# EAGLE design schematic (EAGLE 9.6.2)
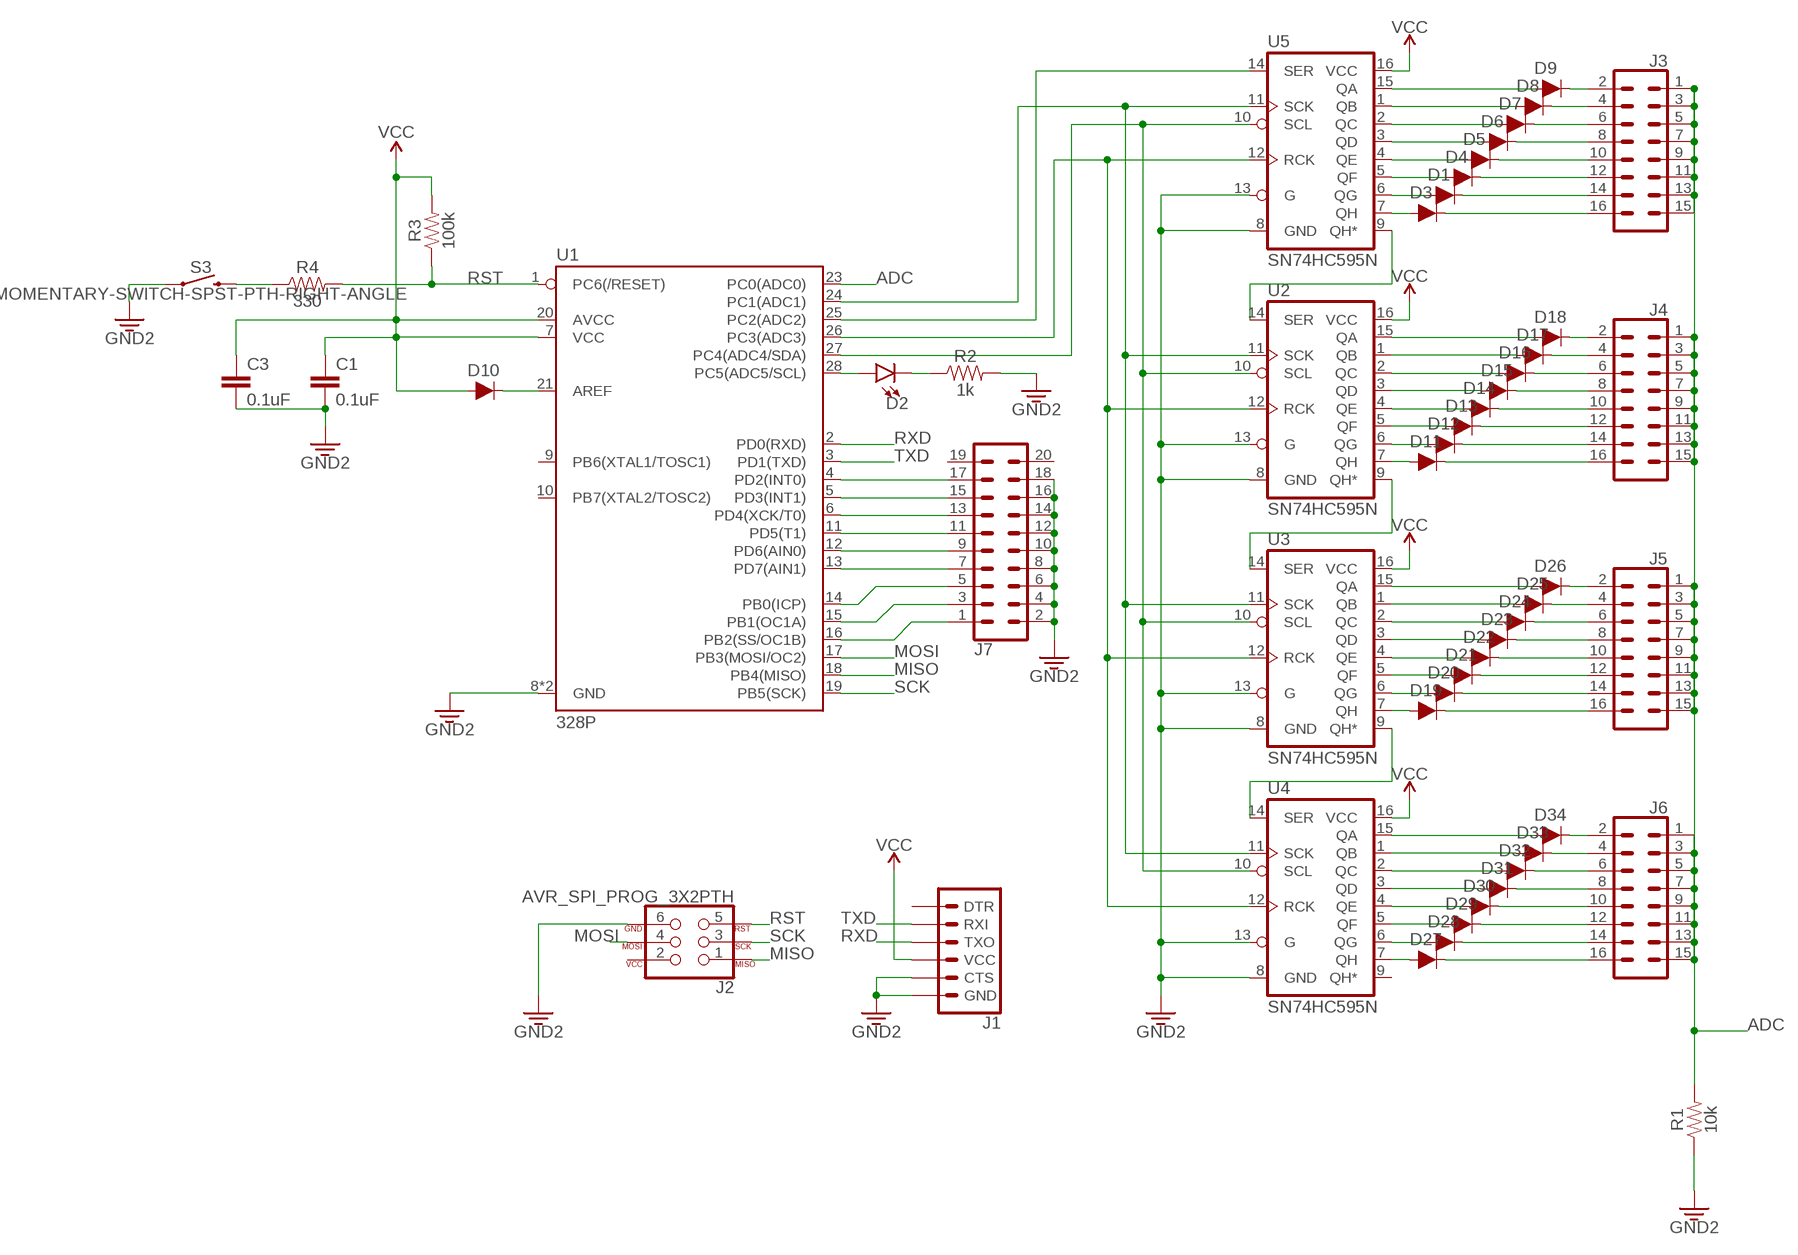
[diagram p0: schematic, sheet 1]

## Parts
C1  0.1uF  0.1UF-KIT-EZ-50V-20%  [CAP-PTH-SMALL-KIT]
C3  0.1uF  0.1UF-KIT-EZ-50V-20%  [CAP-PTH-SMALL-KIT]
D1  200mA/100V/1V  DIODE-1N4148  [DIODE-1N4148]
D2  LED5MM  [LED_5MM]
D3  200mA/100V/1V  DIODE-1N4148  [DIODE-1N4148]
D4  200mA/100V/1V  DIODE-1N4148  [DIODE-1N4148]
D5  200mA/100V/1V  DIODE-1N4148  [DIODE-1N4148]
D6  200mA/100V/1V  DIODE-1N4148  [DIODE-1N4148]
D7  200mA/100V/1V  DIODE-1N4148  [DIODE-1N4148]
D8  200mA/100V/1V  DIODE-1N4148  [DIODE-1N4148]
D9  200mA/100V/1V  DIODE-1N4148  [DIODE-1N4148]
D10  200mA/100V/1V  DIODE-1N4148  [DIODE-1N4148]
D11  200mA/100V/1V  DIODE-1N4148  [DIODE-1N4148]
D12  200mA/100V/1V  DIODE-1N4148  [DIODE-1N4148]
D13  200mA/100V/1V  DIODE-1N4148  [DIODE-1N4148]
D14  200mA/100V/1V  DIODE-1N4148  [DIODE-1N4148]
D15  200mA/100V/1V  DIODE-1N4148  [DIODE-1N4148]
D16  200mA/100V/1V  DIODE-1N4148  [DIODE-1N4148]
D17  200mA/100V/1V  DIODE-1N4148  [DIODE-1N4148]
D18  200mA/100V/1V  DIODE-1N4148  [DIODE-1N4148]
D19  200mA/100V/1V  DIODE-1N4148  [DIODE-1N4148]
D20  200mA/100V/1V  DIODE-1N4148  [DIODE-1N4148]
D21  200mA/100V/1V  DIODE-1N4148  [DIODE-1N4148]
D22  200mA/100V/1V  DIODE-1N4148  [DIODE-1N4148]
D23  200mA/100V/1V  DIODE-1N4148  [DIODE-1N4148]
D24  200mA/100V/1V  DIODE-1N4148  [DIODE-1N4148]
D25  200mA/100V/1V  DIODE-1N4148  [DIODE-1N4148]
D26  200mA/100V/1V  DIODE-1N4148  [DIODE-1N4148]
D27  200mA/100V/1V  DIODE-1N4148  [DIODE-1N4148]
D28  200mA/100V/1V  DIODE-1N4148  [DIODE-1N4148]
D29  200mA/100V/1V  DIODE-1N4148  [DIODE-1N4148]
D30  200mA/100V/1V  DIODE-1N4148  [DIODE-1N4148]
D31  200mA/100V/1V  DIODE-1N4148  [DIODE-1N4148]
D32  200mA/100V/1V  DIODE-1N4148  [DIODE-1N4148]
D33  200mA/100V/1V  DIODE-1N4148  [DIODE-1N4148]
D34  200mA/100V/1V  DIODE-1N4148  [DIODE-1N4148]
J1  6_PIN_SERIAL_TARGETLOCK  [1X06_LOCK]
J2  AVR_SPI_PROG_3X2PTH  [2X3]
J3  CONN_08X2_HEADER  [2X8]
J4  CONN_08X2_HEADER  [2X8]
J5  CONN_08X2_HEADER  [2X8]
J6  CONN_08X2_HEADER  [2X8]
J7  CONN_10X2  [2X10]
R1  10k  10KOHM-HORIZ-1/4W-1%  [AXIAL-0.3]
R2  1k  1KOHM-HORIZ-1/4W-1%  [AXIAL-0.3]
R3  100k  100KOHM-HORIZ-1/4W-5%  [AXIAL-0.3]
R4  330  1KOHM-HORIZ-1/4W-1%  [AXIAL-0.3]
S3  MOMENTARY-SWITCH-SPST-PTH-RIGHT-ANGLE  [TACTILE_SWITCH_PTH_RIGHT_ANGLE]
U1  328P  ATMEGA328P_PDIP  [DIP28]
U2  SN74HC595N  74HC595N  [DIP16]
U3  SN74HC595N  74HC595N  [DIP16]
U4  SN74HC595N  74HC595N  [DIP16]
U5  SN74HC595N  74HC595N  [DIP16]

## Nets
ADC: J3.1 J3.3 J3.5 J3.7 J3.9 J3.11 J3.13 J3.15 J4.1 J4.3 J4.5 J4.7 J4.9 J4.11 J4.13 J4.15 J5.1 J5.3 J5.5 J5.7 J5.9 J5.11 J5.13 J5.15 J6.1 J6.3 J6.5 J6.7 J6.9 J6.11 J6.13 J6.15 R1.P$2 U1.23(PC0(ADC0))
GND: C1.2 C3.2 J1.5(CTS) J1.6(GND) J2.6 J7.2 J7.4 J7.6 J7.8 J7.10 J7.12 J7.14 J7.16 J7.18 R1.P$1 R2.P$2 S3.1 U1.8(GND) U1.22(GND) U2.8(GND) U2.13(G) U3.8(GND) U3.13(G) U4.8(GND) U4.13(G) U5.8(GND) U5.13(G) ; supply symbol labelled GND2
MISO: J2.1 U1.18(PB4(MISO))
MOSI: J2.4 U1.17(PB3(MOSI/OC2))
N$1: U1.24(PC1(ADC1)) U2.11(SCK) U3.11(SCK) U4.11(SCK) U5.11(SCK)
N$2: D18.A U2.15(QA)
N$3: U1.25(PC2(ADC2)) U5.14(SER)
N$4: U1.26(PC3(ADC3)) U2.12(RCK) U3.12(RCK) U4.12(RCK) U5.12(RCK)
N$5: U1.27(PC4(ADC4/SDA)) U2.10(SCL) U3.10(SCL) U4.10(SCL) U5.10(SCL)
N$6: D9.C J3.2
N$7: D8.A U5.1(QB)
N$8: D8.C J3.4
N$9: D9.A U5.15(QA)
N$10: D7.A U5.2(QC)
N$11: D7.C J3.6
N$12: D6.A U5.3(QD)
N$13: D6.C J3.8
N$14: D5.A U5.4(QE)
N$15: D5.C J3.10
N$16: D4.A U5.5(QF)
N$17: D4.C J3.12
N$18: D1.A U5.6(QG)
N$19: D1.C J3.14
N$20: D3.A U5.7(QH)
N$21: D3.C J3.16
N$22: U2.14(SER) U5.9(QH*)
N$23: U2.9(QH*) U3.14(SER)
N$24: U3.9(QH*) U4.14(SER)
N$25: D18.C J4.2
N$26: D17.C J4.4
N$27: D16.C J4.6
N$28: D15.C J4.8
N$29: D14.C J4.10
N$30: D13.C J4.12
N$31: D12.C J4.14
N$32: D11.C J4.16
N$33: D11.A U2.7(QH)
N$34: D12.A U2.6(QG)
N$35: D13.A U2.5(QF)
N$36: D14.A U2.4(QE)
N$37: D15.A U2.3(QD)
N$38: D16.A U2.2(QC)
N$39: D17.A U2.1(QB)
N$40: D26.A U3.15(QA)
N$41: D19.C J5.16
N$42: D20.C J5.14
N$43: D25.A U3.1(QB)
N$44: D24.A U3.2(QC)
N$45: D21.C J5.12
N$46: D22.C J5.10
N$47: D23.A U3.3(QD)
N$48: D22.A U3.4(QE)
N$49: D23.C J5.8
N$50: D24.C J5.6
N$51: D21.A U3.5(QF)
N$52: D20.A U3.6(QG)
N$53: D25.C J5.4
N$54: D26.C J5.2
N$55: D19.A U3.7(QH)
N$56: D34.A U4.15(QA)
N$57: D27.C J6.16
N$58: D28.C J6.14
N$59: D29.C J6.12
N$60: D30.C J6.10
N$61: D31.C J6.8
N$62: D32.C J6.6
N$63: D33.C J6.4
N$64: D34.C J6.2
N$65: D27.A U4.7(QH)
N$66: D28.A U4.6(QG)
N$67: D29.A U4.5(QF)
N$68: D30.A U4.4(QE)
N$69: D31.A U4.3(QD)
N$70: D32.A U4.2(QC)
N$71: D33.A U4.1(QB)
N$72: D10.C U1.21(AREF)
N$73: D2.A U1.28(PC5(ADC5/SCL))
N$74: D2.K(C) R2.P$1
N$75: J7.1 U1.16(PB2(SS/OC1B))
N$76: J7.3 U1.15(PB1(OC1A))
N$77: J7.5 U1.14(PB0(ICP))
N$78: J7.7 U1.13(PD7(AIN1))
N$79: J7.9 U1.12(PD6(AIN0))
N$80: J7.11 U1.11(PD5(T1))
N$81: J7.13 U1.6(PD4(XCK/T0))
N$82: J7.15 U1.5(PD3(INT1))
N$83: J7.17 U1.4(PD2(INT0))
N$84: R4.P$1 S3.2
RST: J2.5 R3.P$1 R4.P$2 U1.1(PC6(/RESET))
RXD: J1.3(TXO) U1.2(PD0(RXD))
SCK: J2.3 U1.19(PB5(SCK))
TXD: J1.2(RXI) U1.3(PD1(TXD))
VCC: C1.1 C3.1 D10.A J1.4(VCC) R3.P$2 U1.7(VCC) U1.20(AVCC) U2.16(VCC) U3.16(VCC) U4.16(VCC) U5.16(VCC)
Unconnected: J1.1(DTR) J2.2 J7.19 J7.20 U1.9(PB6(XTAL1/TOSC1)) U1.10(PB7(XTAL2/TOSC2)) U4.9(QH*)

## Library data of the parts
C1 C3 = SparkFun-Capacitors:0.1UF: 0.1µF ceramic capacitors A capacitor is a passive two-terminal electrical component used to store electrical energy temporarily in an electric field.; PROD_ID: CAP-08370
D1 D3-D34 = SparkFun-DiscreteSemi:DIODE: Diode These are standard reverse protection diodes and small signal diodes. SparkFun Products: SparkFun SparkPunk Sound Kit <https://www.sparkfun.com/products/11177> SparkFun ESP8266 Thing <https://www.sparkfun.com/products/13231>; PROD_ID: DIO-08378
D2 = SparkFun-LED:LED: LED (Generic) Standard schematic elements and footprints for 5mm, 3mm, 1206, and 0603 sized LEDs. Generic LEDs with no color specified.
J1 = SparkFun-Connectors:6_PIN_SERIAL_TARGET: 6-pin header connection for use with the "FTDI BASIC" pinout - TARGET SIDE. Also known as "Arduino Serial Program Header". It is used to mate with our FTDI Basic serial programmers using the Arduino IDE. Note, this device has "TARGET" in the name. It is intended to be used on a design that contains a target micro-controller that you wish to program. The "sister" device, named "CABLE" is inteneded to be used on a design that usually lives on the end of your USB cable and prvides the converter chip (FTDI232 or FTDI231x) to commnicate serial RX/TX. You can populate with some of these: Break Away Headers - Straight <https://www.sparkfun.com/products/116> (PRT-00116) For reference (or to suit your programming needs) check out these designs: SparkFun FTDI Basic Breakout - 5V <https://www.sparkfun.com/products/9716> (DEV-09716) SparkFun FTDI Basic Breakout - 3.3V <https://www.sparkfun.com/products/9873> (DEV-09873) SparkFun FTDI SmartBasic <https://www.sparkfun.com/products/12935> (DEV-12935) SparkFun Beefy 3 - FTDI Basic Breakout <https://www.sparkfun.com/products/13746> (DEV-13746); PROD_ID: CONN-08437
J2 = SparkFun-Connectors:AVR_SPI_PROG_3X2: AVR ISP 6 Pin This is the reduced ISP connector for AVR programming. Common on Arduino. This footprint will take up less PCB space and can be used with a 10-pin to 6-pin adapter such as SKU: BOB-08508 **Special note about "TEST_POINT" package. The stop mask is on the top side, so if you want your programming test points to be on the bottom of your board, make sure to place this package on the bottom side of the board. This also ensure that the orientation to program from the bottom side will be correct. SparkFun Products: SparkFun ISP Pogo Adapter <https://www.sparkfun.com/products/11591> - NS Tiny AVR Programmer <https://www.sparkfun.com/products/11801> -PTH
J3-J6 = SparkFun-Connectors:CONN_08X2: Multi connection point. Often used as Generic Header-pin footprint for 0.1 inch spaced/style header connections You can populate with any combo of single row headers, but if you'd like an exact match, check this: Header - 2x8 (Male, 0.1") <https://www.sparkfun.com/products/13156> (PRT-13156) On any of the 0.1 inch spaced packages, you can populate with these: Break Away Headers - Straight <https://www.sparkfun.com/products/116> (PRT-00116) Break Away Male Headers - Right Angle <https://www.sparkfun.com/products/553> (PRT-00553) Female Headers <https://www.sparkfun.com/products/115> (PRT-00115) Break Away Headers - Machine Pin <https://www.sparkfun.com/products/117> (PRT-00117) Break Away Female Headers - Swiss Machine Pin <https://www.sparkfun.com/products/743> (PRT-00743)
J7 = SparkFun-Connectors:CONN_10X2: Multi connection point. Often used as Generic Header-pin footprint for 0.1 inch spaced/style header connections On any of the 0.1 inch spaced packages, you can populate with these: Break Away Headers - Straight <https://www.sparkfun.com/products/116> (PRT-00116) Break Away Male Headers - Right Angle <https://www.sparkfun.com/products/553> (PRT-00553) Female Headers <https://www.sparkfun.com/products/115> (PRT-00115) Break Away Headers - Machine Pin <https://www.sparkfun.com/products/117> (PRT-00117) Break Away Female Headers - Swiss Machine Pin <https://www.sparkfun.com/products/743> (PRT-00743) Special note about the "SPECIAL" package: This was SPECIALLY designed to be used with our Graphic LCD Backpack. Be sure you want to use this! It is not only staggered on each line of header holes, but IT IS ALSO offset of the center point of the top and bottom lines by 5 mil. This causes the headers to lock into place on the "standard" footprint on the LCD screen. The extra squares on the tdocu layer are there simply to reference other pins (if you were to actually populate a longer header than ten long - this is what we do with the backpacks).
R1 = SparkFun-Resistors:10KOHM: 10kΩ resistor A resistor is a passive two-terminal electrical component that implements electrical resistance as a circuit element. Resistors act to reduce current flow, and, at the same time, act to lower voltage levels within circuits. - Wikipedia; PROD_ID: RES-12183
R2 = SparkFun-Resistors:1KOHM: 1kΩ resistor A resistor is a passive two-terminal electrical component that implements electrical resistance as a circuit element. Resistors act to reduce current flow, and, at the same time, act to lower voltage levels within circuits. - Wikipedia; PROD_ID: RES-12182
R3 = SparkFun-Resistors:100KOHM: 100kΩ resistor A resistor is a passive two-terminal electrical component that implements electrical resistance as a circuit element. Resistors act to reduce current flow, and, at the same time, act to lower voltage levels within circuits. - Wikipedia; PROD_ID: RES-10686
R4 = SparkFun-Resistors:1KOHM: 1kΩ resistor A resistor is a passive two-terminal electrical component that implements electrical resistance as a circuit element. Resistors act to reduce current flow, and, at the same time, act to lower voltage levels within circuits. - Wikipedia; PROD_ID: RES-12182; VALUE: 1k
S3 = SparkFun-Switches:MOMENTARY-SWITCH-SPST: Momentary Switch (Pushbutton) - SPST Normally-open (NO) SPST momentary switches (buttons, pushbuttons). Variants PTH-12MM - 12mm square, through-hole Momentary Pushbutton Switch - 12mm Square <https://www.sparkfun.com/products/9190> (COM-09190) PTH-6.0MM, PTH-6.0MM-KIT - 6.0mm square, through-hole Mini Pushbutton Switch <https://www.sparkfun.com/products/97> (COM-00097) KIT package intended for soldering kit's - only one side of pads' copper is exposed. PTH-RIGHT-ANGLE-KIT - Right-angle, through-hole Right Angle Tactile Button <https://www.sparkfun.com/products/10791> - Used on SparkFun BigTime Watch Kit <https://www.sparkfun.com/products/11734> SMD-12MM - 12mm square, surface-mount Tactile Button - SMD (12mm) <https://www.sparkfun.com/products/12993> (COM-12993) Used on SparkFun PicoBoard <https://www.sparkfun.com/products/11888> SMD-4.5MM - 4.5mm Square Trackball Switch Used on SparkFun Blackberry Trackballer Breakout <https://www.sparkfun.com/products/13169> SMD-4.6MMX2.8MM - 4.60mm x 2.80mm, surface mount Used on SparkFun Pro Micro - RP2040 <https://www.sparkfun.com/products/17717> SMD-5.2MM, SMD-5.2-REDUNDANT - 5.2mm square, surface-mount Mini Pushbutton Switch - SMD <https://www.sparkfun.com/products/8720> (COM-08720) Used on Arduino Pro Mini <https://www.sparkfun.com/products/11114> REDUNDANT package connects both switch circuits together SMD-6.0X3.5MM - 6.0 x 3.5mm, surface mount Momentary Reset Switch SMD <https://www.sparkfun.com/products/8229> (COM-08229) SMD-6.2MM-TALL - 6.2mm square, surface mount Tactile Button - SMD (6mm) <https://www.sparkfun.com/products/12992> Used on SparkFun Digital Sandbox <https://www.sparkfun.com/products/12651> SMD-RIGHT-ANGLE - Right-angle, surface mount Used on SparkFun Block for Intel® Edison - Arduino <https://www.sparkfun.com/products/13036>; PROD_ID: CONN-10672; SF_SKU: COM-10791
U1 = SparkFun-IC-Microcontroller:ATMEGA328P_PDIP: Atmel 328P Through hole ATMEGA328P uC used in the Arduino 32kb flash, 1k EEPROM, 2k SRAM Datasheet <http://www.sparkfun.com/datasheets/Components/SMD/ATMega328.pdf> SparkFun Products Storefront component: AVR 28 Pin 20MHz 32K 6A/D - ATMega328P <https://www.sparkfun.com/products/9061> (COM-09061) SparkFun Simon Says - Through-Hole Soldering Kit <https://www.sparkfun.com/products/10547> (KIT-10547) SparkFun Learn to Solder - Simon Says <https://www.sparkfun.com/products/13708> (KIT-13708) SparkFun BigTime Watch Kit <https://www.sparkfun.com/products/11734> (KIT-11734) SparkFun ClockIt <https://www.sparkfun.com/products/10930> (KIT-10930) SparkFun Serial Enabled LCD Kit <https://www.sparkfun.com/products/10097> (LCD-10097) SparkFun Simon Tilts - Through Hole Soldering Kit <https://www.sparkfun.com/products/12634> (KIT-12634) SparkFun Frequency Counter Kit <https://www.sparkfun.com/products/10140> (KIT-10140) FabFM Radio Kit <https://www.sparkfun.com/products/11043> (KIT-11043) SparkFun Binary Blaster Kit <https://www.sparkfun.com/products/12037> (KIT-12037) SparkFun Metro-Gnome <https://www.sparkfun.com/products/9236> (KIT-09236) ATmega328 with Arduino Optiboot (Uno) <https://www.sparkfun.com/products/10524> (DEV-10524); PROD_ID: IC-09136
U2-U5 = SparkFun-IC-Logic:74*595: 8-Bit Shift Register (Serial to Parallel) Datasheet <http://cdn.sparkfun.com/datasheets/BreakoutBoards/MM74HC595.pdf> SparkFun Products SparkFun Shift Register Breakout - 74HC595 <https://www.sparkfun.com/products/10680> (BOB-10680); PROD_ID: IC-13123

## Board
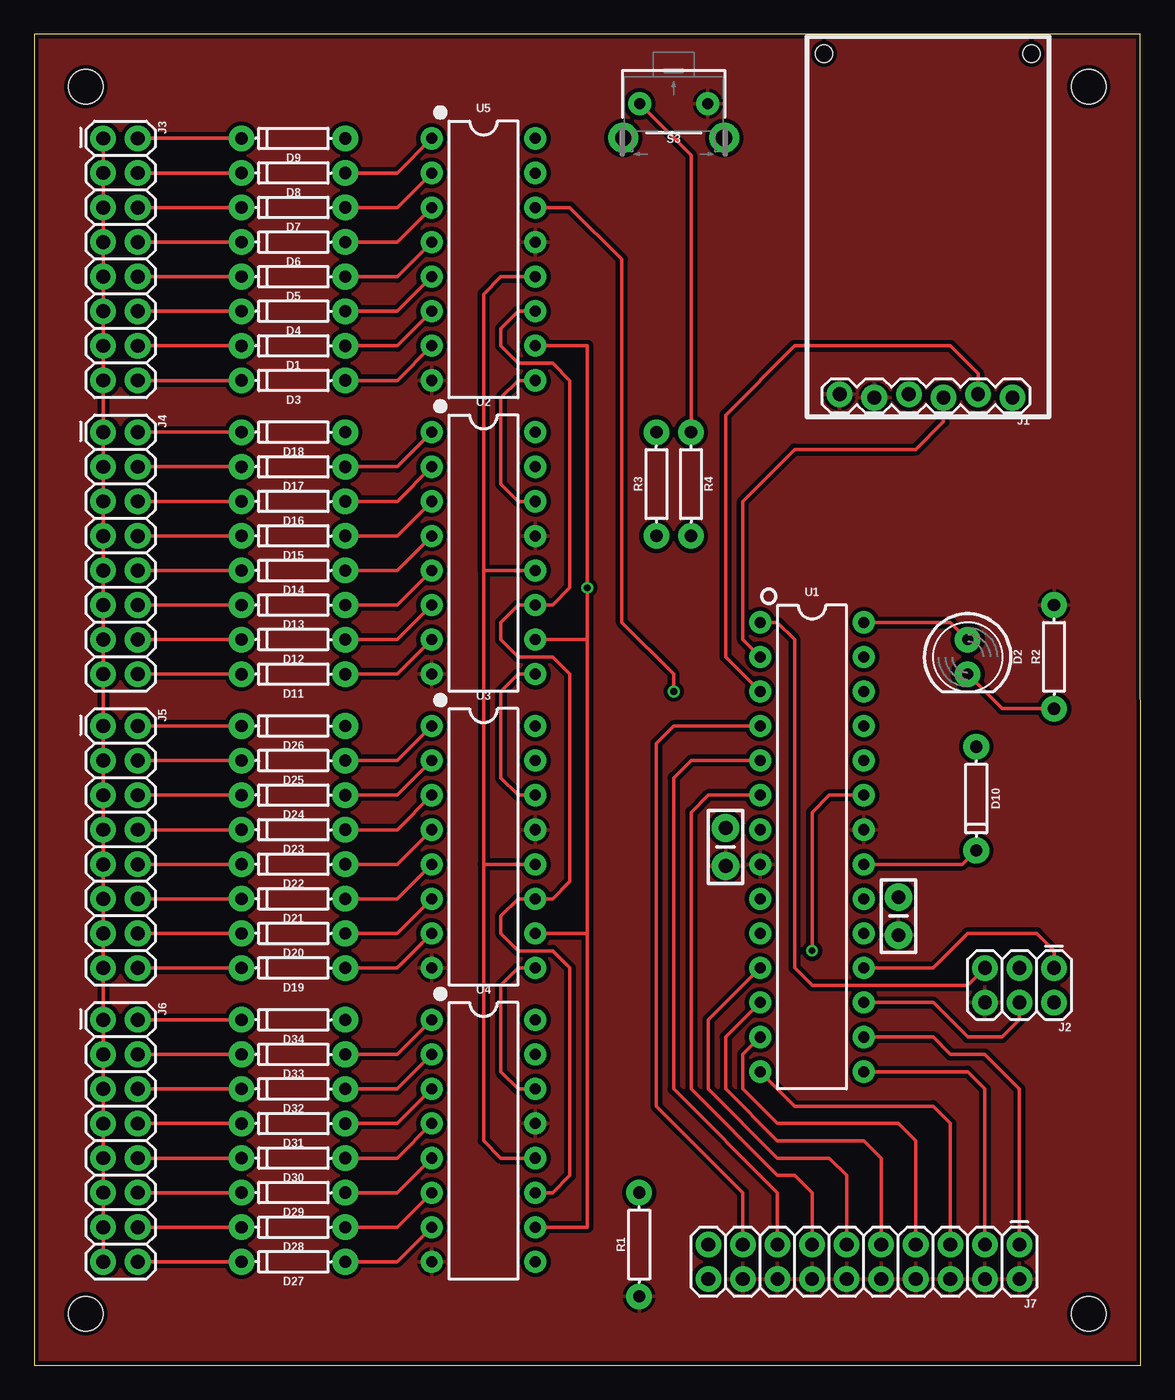
[diagram p1: board, top side]
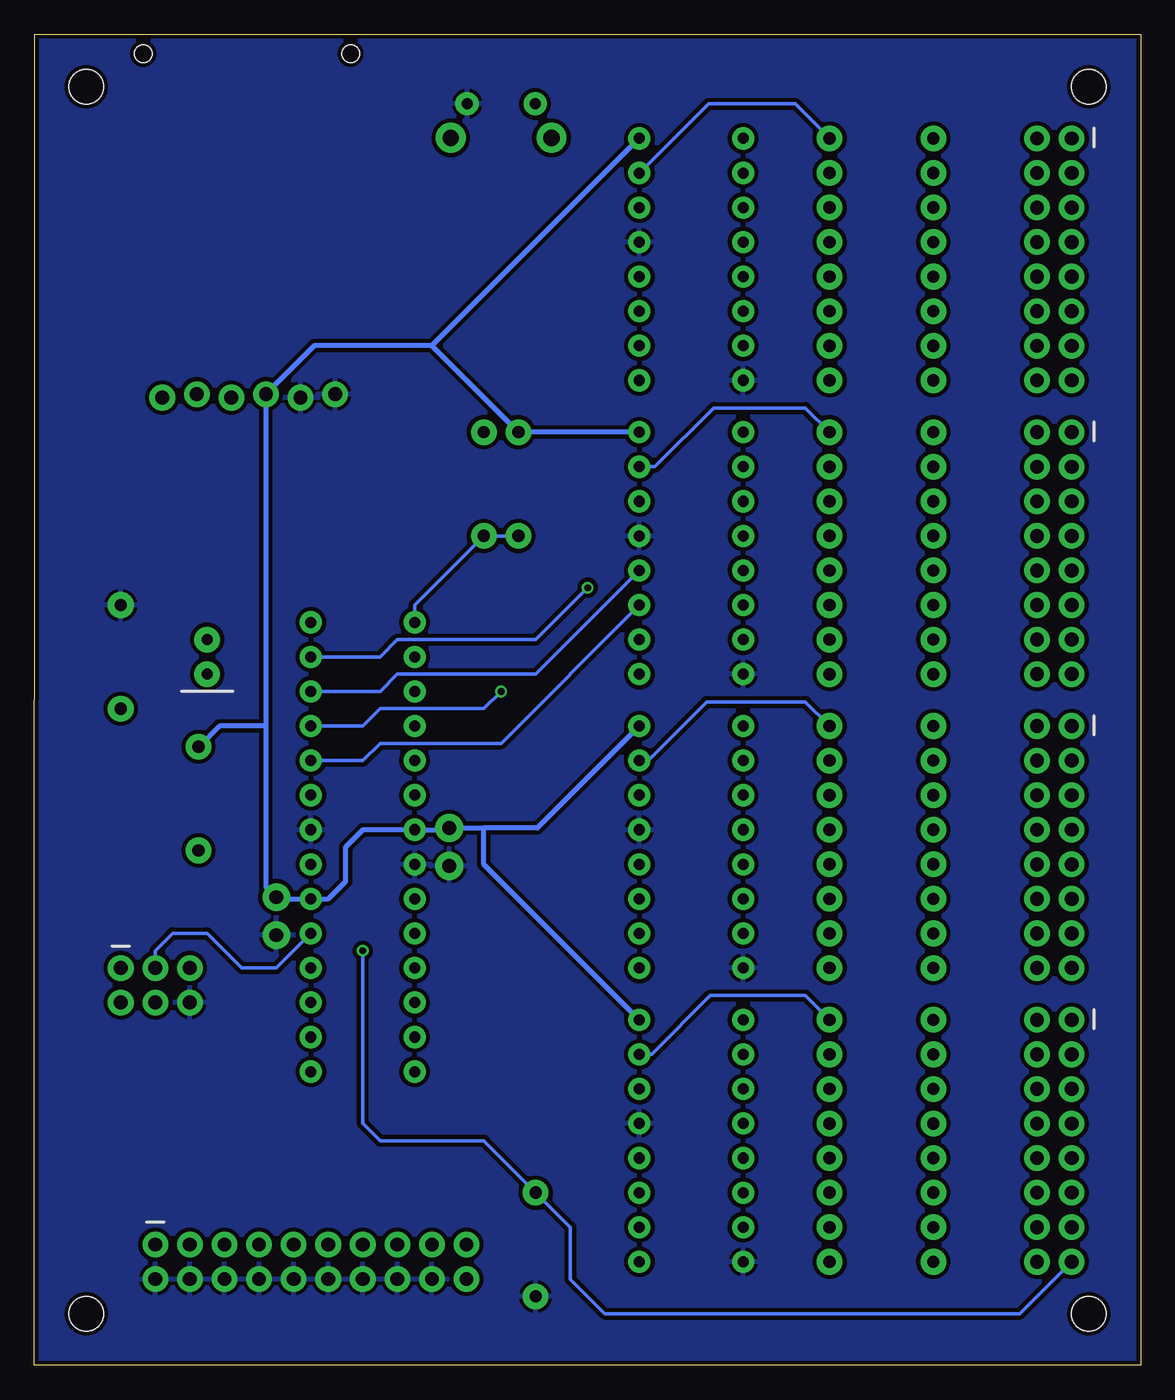
[diagram p2: board, bottom side, seen from below]

Size 81.3 x 97.84 mm. Coordinates in mm from the lower left corner, seen from the top.
Outline: 0,0 81.3,0 81.26,97.84 0,97.84 0,0
Copper layers (1*16): Top 0.035mm / dielectric 1.5mm / Bottom 0.035mm
Design rules "SparkFun-2-Layer-General-JLCPCB": minimum track width 7mil, minimum drill 0.3mm, track to track 7mil, track to pad 7mil, pad to pad 7mil, via to via 7mil, smd to smd 7mil, copper to edge 7mil, drill to drill 7mil, minimum pad ring 7mil, minimum via ring 7mil, stop-mask expansion 3mil, vias tented up to drill 25mil, thermal gap 10mil
Holes 1.27 mm at 73.28,96.39 58.04,96.39
Holes 2.54 mm at 77.47,93.98 77.47,3.81 3.81,3.81 3.81,93.98

### Footprints (pad centres in the part's own frame; a part is rotated, then mirrored left to right if it is on the bottom)
CAP-PTH-SMALL-KIT = drill 1.016 pad 2.032: 1 -1.397,0; 2 1.397,0
DIODE-1N4148 = drill 0.9 pad 1.88: A -3.81,0; C 3.81,0
LED_5MM = drill 0.813 pad 1.88: A -1.27,0; K 1.27,0
1X06_LOCK = drill 1.016 pad 1.88: 1 0,0; 2 2.54,-0.254; 3 5.08,0; 4 7.62,-0.254; 5 10.16,0; 6 12.7,-0.254
2X3 = drill 1.016 pad 1.88: 1 0,0; 2 0,2.54; 3 2.54,0; 4 2.54,2.54; 5 5.08,0; 6 5.08,2.54
2X8 = drill 1.016 pad 1.88: 1 0,0; 2 0,2.54; 3 2.54,0; 4 2.54,2.54; 5 5.08,0; 6 5.08,2.54; 7 7.62,0; 8 7.62,2.54; 9 10.16,0; 10 10.16,2.54; 11 12.7,0; 12 12.7,2.54; 13 15.24,0; 14 15.24,2.54; 15 17.78,0; 16 17.78,2.54
2X10 = drill 1.016 pad 1.88: 1 0,0; 2 0,2.54; 3 2.54,0; 4 2.54,2.54; 5 5.08,0; 6 5.08,2.54; 7 7.62,0; 8 7.62,2.54; 9 10.16,0; 10 10.16,2.54; 11 12.7,0; 12 12.7,2.54; 13 15.24,0; 14 15.24,2.54; 15 17.78,0; 16 17.78,2.54; 17 20.32,0; 18 20.32,2.54; 19 22.86,0; 20 22.86,2.54
AXIAL-0.3 = drill 0.9 pad 1.88: P$1 -3.81,0; P$2 3.81,0
TACTILE_SWITCH_PTH_RIGHT_ANGLE = drill 0.8 pad 1.7: 1 -2.5,0; 2 2.5,0 | drill 1.2 pad 2.2: ANCHOR1 -3.703,2.5; ANCHOR2 3.703,2.5
DIP28 = drill 0.813 pad 1.626: 1 -16.51,-3.81; 2 -13.97,-3.81; 3 -11.43,-3.81; 4 -8.89,-3.81; 5 -6.35,-3.81; 6 -3.81,-3.81; 7 -1.27,-3.81; 8 1.27,-3.81; 9 3.81,-3.81; 10 6.35,-3.81; 11 8.89,-3.81; 12 11.43,-3.81; 13 13.97,-3.81; 14 16.51,-3.81; 15 16.51,3.81; 16 13.97,3.81; 17 11.43,3.81; 18 8.89,3.81; 19 6.35,3.81; 20 3.81,3.81; 21 1.27,3.81; 22 -1.27,3.81; 23 -3.81,3.81; 24 -6.35,3.81; 25 -8.89,3.81; 26 -11.43,3.81; 27 -13.97,3.81; 28 -16.51,3.81
DIP16 = drill 0.813 pad 1.626: 1 -8.89,-3.81; 2 -6.35,-3.81; 3 -3.81,-3.81; 4 -1.27,-3.81; 5 1.27,-3.81; 6 3.81,-3.81; 7 6.35,-3.81; 8 8.89,-3.81; 9 8.89,3.81; 10 6.35,3.81; 11 3.81,3.81; 12 1.27,3.81; 13 -1.27,3.81; 14 -3.81,3.81; 15 -6.35,3.81; 16 -8.89,3.81

### Placement (x,y rotation side)
C1  50.8,38.1 270 top
C3  63.5,33.02 270 top
D1  19.05,74.93 180 top
D2  68.58,52.07 270 top
D3  19.05,72.39 180 top
D4  19.05,77.47 180 top
D5  19.05,80.01 180 top
D6  19.05,82.55 180 top
D7  19.05,85.09 180 top
D8  19.05,87.63 180 top
D9  19.05,90.17 180 top
D10  69.22,41.66 270 top
D11  19.05,50.8 180 top
D12  19.05,53.34 180 top
D13  19.05,55.88 180 top
D14  19.05,58.42 180 top
D15  19.05,60.96 180 top
D16  19.05,63.5 180 top
D17  19.05,66.04 180 top
D18  19.05,68.58 180 top
D19  19.05,29.21 180 top
D20  19.05,31.75 180 top
D21  19.05,34.29 180 top
D22  19.05,36.83 180 top
D23  19.05,39.37 180 top
D24  19.05,41.91 180 top
D25  19.05,44.45 180 top
D26  19.05,46.99 180 top
D27  19.05,7.62 180 top
D28  19.05,10.16 180 top
D29  19.05,12.7 180 top
D30  19.05,15.24 180 top
D31  19.05,17.78 180 top
D32  19.05,20.32 180 top
D33  19.05,22.86 180 top
D34  19.05,25.4 180 top
J1  71.88,71.12 180 top
J2  74.93,29.21 180 top
J3  5.08,90.17 270 top
J4  5.08,68.58 270 top
J5  5.08,46.99 270 top
J6  5.08,25.4 270 top
J7  72.39,8.89 180 top
R1  44.45,8.89 90 top
R2  74.93,52.07 90 top
R3  45.72,64.77 90 top
R4  48.26,64.77 270 top
S3  46.99,92.71 180 top
U1  57.15,38.1 270 top
U2  33.02,59.69 270 top
U3  33.02,38.1 270 top
U4  33.02,16.51 270 top
U5  33.02,81.28 270 top

### Tracks (layer width: path | path; a pad name or v marks a point on that pad's centre or on a via)
ADC  (via drill 0.51)
  Top 0.254: J4.3 J3.15 J3.13 J3.11 J3.9 J3.7 J3.5 J3.3 J3.1 | J4.1 J4.3 | J4.3 J4.5 J4.7 J4.9 J4.11 J4.13 J4.15 J5.1 J5.3 J5.5 J5.7 J5.9 J5.11 J5.13 J5.15 J6.1 J6.3 J6.5 J6.7 J6.9 J6.11 J6.13 J6.15 | v57.15,30.48 57.15,40.64 58.42,41.91 U1.23
  Bottom 0.254: v57.15,30.48 57.15,17.78 55.88,16.51 48.26,16.51 R1.P$2 41.91,10.16 41.91,6.35 39.37,3.81 8.89,3.81 J6.15
GND
  pour Top (isolate 0.305): 0,97.79 0,0 81.28,0 81.28,97.79
  pour Bottom (isolate 0.305): 0,97.79 81.28,97.79 81.28,0 0,0
MISO
  Top 0.254: J2.1 74.93,30.48 73.66,31.75 68.58,31.75 66.04,29.21 U1.18
MOSI
  Top 0.254: U1.17 66.04,26.67 68.58,24.13 71.12,24.13 72.39,25.4 J2.4
N$1
  Top 0.254: U5.11 35.56,77.47 34.29,76.2 34.29,74.93 35.56,73.66 38.1,73.66 39.37,72.39 39.37,57.15 38.1,55.88 U2.11 35.56,55.88 34.29,54.61 34.29,53.34 35.56,52.07 38.1,52.07 39.37,50.8 39.37,35.56 38.1,34.29 U3.11 35.56,34.29 34.29,33.02 34.29,31.75 35.56,30.48 38.1,30.48 39.37,29.21 39.37,13.97 38.1,12.7 U4.11
  Bottom 0.254: U1.24 57.15,44.45 55.88,45.72 46.99,45.72 U2.11
N$2
  Bottom 0.254: U2.15 35.69,66.04 31.37,70.36 24.64,70.36 D18.A
N$3  (via drill 0.51)
  Top 0.254: U5.14 39.37,85.09 43.18,81.28 43.18,54.61 46.99,50.8 v46.99,49.53
  Bottom 0.254: U1.25 57.15,46.99 55.88,48.26 48.26,48.26 v46.99,49.53
N$4
  Top 0.254: 33.02,58.42 33.02,78.74 34.29,80.01 U5.12 | 33.02,58.42 33.02,36.83 | U3.12 33.02,36.83 | 33.02,36.83 33.02,16.51 34.29,15.24 U4.12 | 33.02,58.42 U2.12
  Bottom 0.254: U1.26 55.88,49.53 54.61,50.8 44.45,50.8 U2.12
N$5  (via drill 0.51)
  Top 0.254: U5.10 40.64,74.93 v40.64,57.15 40.64,53.34 | 40.64,53.34 U2.10 | 40.64,53.34 40.64,31.75 | U3.10 40.64,31.75 | 40.64,31.75 40.64,10.16 U4.10
  Bottom 0.254: U1.27 55.88,52.07 54.61,53.34 44.45,53.34 v40.64,57.15
N$6
  Top 0.254: D9.C J3.2
N$7
  Top 0.254: U5.1 26.67,87.63 D8.A
N$8
  Top 0.254: J3.4 D8.C
N$9
  Bottom 0.254: U5.15 31.75,92.71 25.4,92.71 D9.A
N$10
  Top 0.254: U5.2 26.67,85.09 D7.A
N$11
  Top 0.254: D7.C J3.6
N$12
  Top 0.254: U5.3 26.67,82.55 D6.A
N$13
  Top 0.254: J3.8 D6.C
N$14
  Top 0.254: U5.4 26.67,80.01 D5.A
N$15
  Top 0.254: D5.C J3.10
N$16
  Top 0.254: U5.5 26.67,77.47 D4.A
N$17
  Top 0.254: J3.12 D4.C
N$18
  Top 0.254: U5.6 26.67,74.93 D1.A
N$19
  Top 0.254: D1.C J3.14
N$20
  Top 0.254: U5.7 26.67,72.39 D3.A
N$21
  Top 0.254: J3.16 D3.C
N$22
  Top 0.254: U5.9 35.56,72.39 34.29,71.12 34.29,64.77 35.56,63.5 U2.14
N$23
  Top 0.254: U2.9 35.56,50.8 34.29,49.53 34.29,43.18 35.56,41.91 U3.14
N$24
  Top 0.254: U3.9 35.56,29.21 34.29,27.94 34.29,21.59 35.56,20.32 U4.14
N$25
  Top 0.254: J4.2 D18.C
N$26
  Top 0.254: D17.C J4.4
N$27
  Top 0.254: J4.6 D16.C
N$28
  Top 0.254: D15.C J4.8
N$29
  Top 0.254: J4.10 D14.C
N$30
  Top 0.254: D13.C J4.12
N$31
  Top 0.254: J4.14 D12.C
N$32
  Top 0.254: D11.C J4.16
N$33
  Top 0.254: U2.7 26.67,50.8 D11.A
N$34
  Top 0.254: U2.6 26.67,53.34 D12.A
N$35
  Top 0.254: U2.5 26.67,55.88 D13.A
N$36
  Top 0.254: U2.4 26.67,58.42 D14.A
N$37
  Top 0.254: U2.3 26.67,60.96 D15.A
N$38
  Top 0.254: U2.2 26.67,63.5 D16.A
N$39
  Top 0.254: U2.1 26.67,66.04 D17.A
N$40
  Bottom 0.254: U3.15 36.19,44.45 31.88,48.77 24.64,48.77 D26.A
N$41
  Top 0.254: J5.16 D19.C
N$42
  Top 0.254: D20.C J5.14
N$43
  Top 0.254: U3.1 26.67,44.45 D25.A
N$44
  Top 0.254: U3.2 26.67,41.91 D24.A
N$45
  Top 0.254: J5.12 D21.C
N$46
  Top 0.254: D22.C J5.10
N$47
  Top 0.254: U3.3 26.67,39.37 D23.A
N$48
  Top 0.254: U3.4 26.67,36.83 D22.A
N$49
  Top 0.254: J5.8 D23.C
N$50
  Top 0.254: D24.C J5.6
N$51
  Top 0.254: U3.5 26.67,34.29 D21.A
N$52
  Top 0.254: U3.6 26.67,31.75 D20.A
N$53
  Top 0.254: J5.4 D25.C
N$54
  Top 0.254: D26.C J5.2
N$55
  Top 0.254: U3.7 26.67,29.21 D19.A
N$56
  Bottom 0.254: U4.15 35.94,22.86 31.62,27.18 24.64,27.18 D34.A
N$57
  Top 0.254: J6.16 D27.C
N$58
  Top 0.254: D28.C J6.14
N$59
  Top 0.254: J6.12 D29.C
N$60
  Top 0.254: D30.C J6.10
N$61
  Top 0.254: J6.8 D31.C
N$62
  Top 0.254: D32.C J6.6
N$63
  Top 0.254: J6.4 D33.C
N$64
  Top 0.254: D34.C J6.2
N$65
  Top 0.254: U4.7 26.67,7.62 D27.A
N$66
  Top 0.254: U4.6 26.67,10.16 D28.A
N$67
  Top 0.254: U4.5 26.67,12.7 D29.A
N$68
  Top 0.254: U4.4 26.67,15.24 D30.A
N$69
  Top 0.254: U4.3 26.67,17.78 D31.A
N$70
  Top 0.254: U4.2 26.67,20.32 D32.A
N$71
  Top 0.254: U4.1 26.67,22.86 D33.A
N$72
  Top 0.254: U1.21 68.2,36.83 D10.C
N$73
  Top 0.254: U1.28 67.31,54.61 D2.A
N$74
  Top 0.254: D2.K 71.12,48.26 R2.P$1
N$75
  Top 0.254: U1.16 66.04,24.13 67.31,22.86 69.85,22.86 72.39,20.32 J7.1
N$76
  Top 0.254: U1.15 68.58,21.59 69.85,20.32 J7.3
N$77
  Top 0.254: U1.14 55.88,19.05 66.04,19.05 67.31,17.78 J7.5
N$78
  Top 0.254: U1.13 52.07,22.86 52.07,20.32 54.61,17.78 63.5,17.78 64.77,16.51 J7.7
N$79
  Top 0.254: U1.12 50.8,24.13 50.8,20.32 54.61,16.51 60.96,16.51 62.23,15.24 J7.9
N$80
  Top 0.254: U1.11 49.53,25.4 49.53,20.32 54.61,15.24 58.42,15.24 59.69,13.97 J7.11
N$81
  Top 0.254: U1.6 49.53,41.91 48.26,40.64 48.26,20.32 54.61,13.97 55.88,13.97 57.15,12.7 J7.13
N$82
  Top 0.254: U1.5 48.26,44.45 46.99,43.18 46.99,20.32 54.61,12.7 J7.15
N$83
  Top 0.254: U1.4 46.99,46.99 45.72,45.72 45.72,19.05 52.07,12.7 J7.17
N$84
  Top 0.254: S3.2 48.26,88.94 R4.P$1
RST
  Top 0.254: J2.5 68.58,27.94 57.15,27.94 55.88,29.21 55.88,53.34 54.61,54.61 U1.1
  Bottom 0.254: U1.1 53.34,55.88 R4.P$2 R3.P$1
RXD
  Top 0.254: U1.2 52.07,53.34 52.07,63.5 55.88,67.31 64.77,67.31 66.8,69.34 J1.3
SCK
  Bottom 0.254: J2.3 72.39,30.48 71.12,31.75 68.58,31.75 66.04,29.21 63.5,29.21 U1.19
TXD
  Top 0.254: U1.3 50.8,52.07 50.8,69.85 55.88,74.93 67.31,74.93 69.34,72.9 J1.2
VCC
  Bottom 0.381: 48.26,39.5 C1.1 50.93,39.37 U1.7 57.15,39.37 58.42,38.1 58.42,35.56 59.69,34.29 U1.20 63.37,34.29 C3.1 64.26,35.18 64.26,46.99 | U4.16 48.26,36.83 48.26,39.5 | U2.16 R3.P$2 52.07,74.93 | U5.16 52.07,74.93 | 52.07,74.93 60.71,74.93 J1.4 64.26,46.99 | 64.26,46.99 67.69,46.99 D10.A | 48.26,39.5 44.32,39.5 U3.16